# Altium schematic sheet battery-select.SchDoc: Battery Selection
size A4; Date: 23 Sept 2024; Author: Aaron Huinink; CompanyName: FLoRa Communications; DrawnBy: Aaron Huinink; Revision: 1; SheetNumber: 5; SheetTotal: 5; Time: 16:30
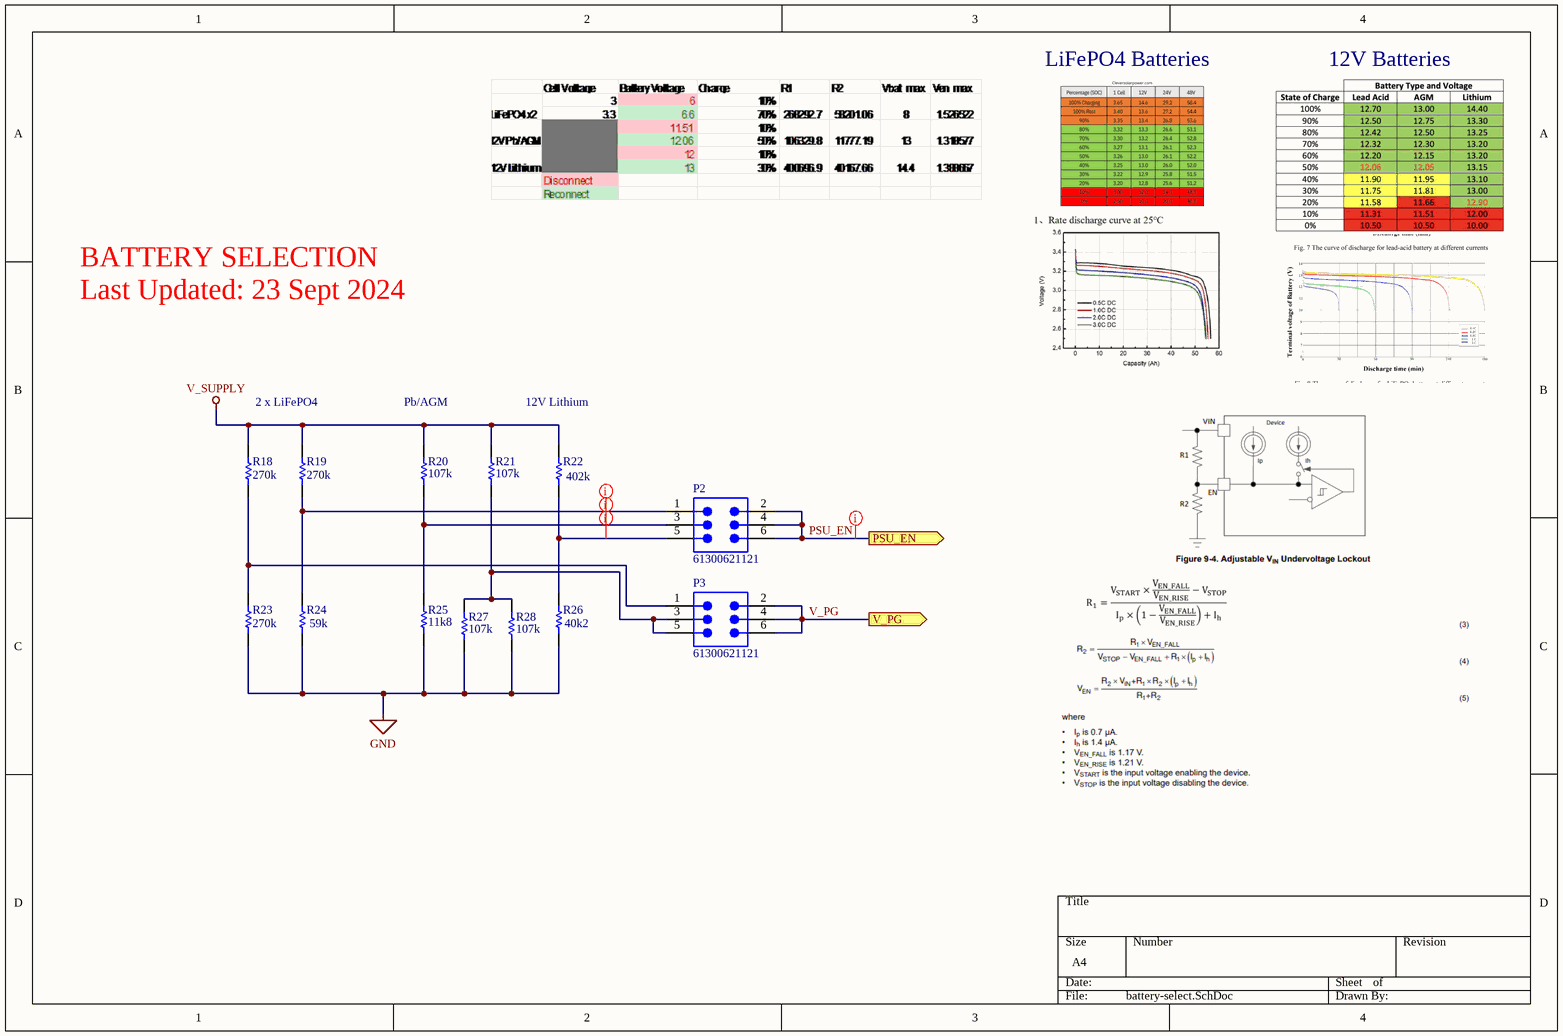
[diagram p0: battery-select.SchDoc]

## Parts
P2  61300621121  [61300621121]
P3  61300621121  [61300621121]
R18  value 270k  [RESC2013X70X40LL20T20]  (hidden comment: ERJ6ENF2703V)
R19  value 270k  [RESC2013X70X40LL20T20]  (hidden comment: ERJ6ENF2703V)
R20  value 107k  [RESC2013X70X40LL20T20]  (hidden comment: ERJ-6ENF1073V)
R21  value 107k  [RESC2013X70X40LL20T20]  (hidden comment: ERJ-6ENF1073V)
R22  value 402k  [RESC2013X70X40LL20T20]  (hidden comment: ERJ-6ENF4023V)
R23  value 270k  [RESC2013X70X40LL20T20]  (hidden comment: ERJ6ENF2703V)
R24  value 59k  [RESC2013X70X40LL20T20]  (hidden comment: ERJ-6ENF5902V)
R25  value 11k8  [RESC2013X70X40LL20T20]  (hidden comment: ERJ-6ENF1182V)
R26  value 40k2  [RESC2013X70X40LL20T20]  (hidden comment: ERJ-6ENF4022V)
R27  value 107k  [RESC2013X70X40LL20T20]  (hidden comment: ERJ-6ENF1073V)
R28  value 107k  [RESC2013X70X40LL20T20]  (hidden comment: ERJ-6ENF1073V)

## Ports
PSU_EN (out), V_PG (out)

## Nets
GND: R23.1 R24.1 R25.1 R26.1 R27.1 R28.1
V_SUPPLY: R18.2 R19.2 R20.2 R21.2 R22.2
PSU_EN: P2.2 P2.4 P2.6 ; port PSU_EN
V_PG: P3.2 P3.4 P3.6 ; port V_PG
NetP2_1: P2.1 R19.1 R24.2
NetP2_3: P2.3 R20.1 R25.2
NetP2_5: P2.5 R22.1 R26.2
NetP3_1: P3.1 R18.1 R23.2
NetP3_3: P3.3 P3.5 R21.1 R27.2 R28.2

## Layout directives
net class ANALOG: NetP2_1, NetP2_3, NetP2_5, PSU_EN

## Notes on the sheet
- LiFePO4 Batteries
- 12V Batteries
- BATTERY SELECTION
  Last Updated: 23 Sept 2024
- 2 x LiFePO4
- Pb/AGM
- 12V Lithium

## Library data of the parts
P2 P3 = CMP-002-00112-1: Board Connector, 6 Contact(s), 2 Row(s), Male, Straight, 0.1 inch Pitch, Solder Terminal, Black Insulator, Plug; Max Operating Temperature: 125°C; Mounting Technology: Board; Connector Type: BOARD CONNECTOR; Min Operating Temperature: -40°C; RoHS Compliant: Yes
R18 R19 R23 = CMP-2001-00528-1: Manufacturer: Panasonic; Part Number: ERJ6ENF2703V
R20 R21 R27 R28 = CMP-2001-04390-1: Manufacturer: Panasonic; Part Number: ERJ-6ENF1073V
R22 = CMP-2001-00170-1: Manufacturer: Panasonic; Part Number: ERJ-6ENF4023V
R24 = CMP-2001-00247-1: Manufacturer: Panasonic; Part Number: ERJ-6ENF5902V
R25 = CMP-2001-04399-1: Manufacturer: Panasonic; Part Number: ERJ-6ENF1182V
R26 = CMP-2001-00169-1: Manufacturer: Panasonic; Part Number: ERJ-6ENF4022V